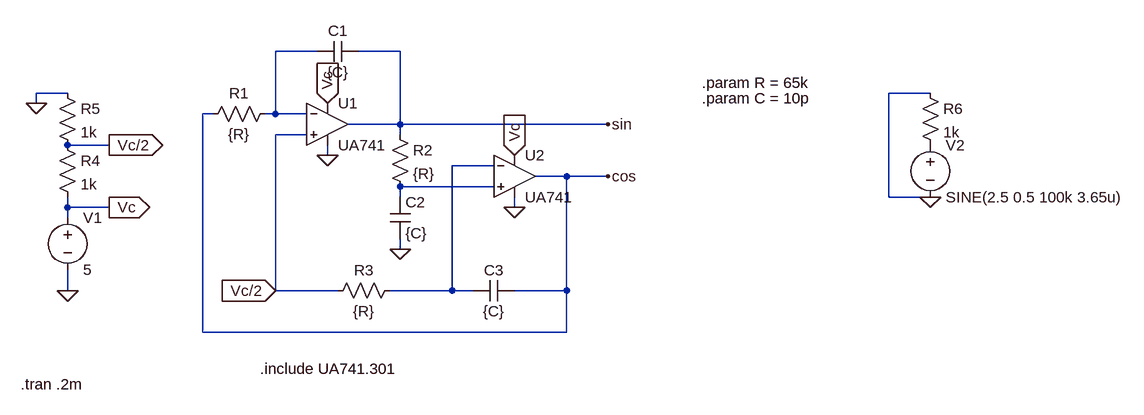
[diagram p0: schematic oscillator.asc]
oscillator.asc, the LTspice schematic file:
Version 4
SHEET 1 1364 680
WIRE 96 -160 32 -160
WIRE 224 -160 160 -160
WIRE -288 -96 -336 -96
WIRE 1040 -96 976 -96
WIRE -336 -80 -336 -96
WIRE -64 -64 -80 -64
WIRE 32 -64 32 -160
WIRE 32 -64 16 -64
WIRE 80 -64 32 -64
WIRE 224 -48 224 -160
WIRE 224 -48 144 -48
WIRE 544 -48 224 -48
WIRE 80 -32 32 -32
WIRE 224 -32 224 -48
WIRE -224 -16 -288 -16
WIRE 112 0 112 -16
WIRE 368 16 304 16
WIRE 480 32 432 32
WIRE 544 32 480 32
WIRE 368 48 224 48
WIRE 224 64 224 48
WIRE 976 64 976 -96
WIRE 1040 64 976 64
WIRE -288 80 -288 64
WIRE -224 80 -288 80
WIRE 400 80 400 64
WIRE -288 96 -288 80
WIRE 224 144 224 128
WIRE -288 208 -288 176
WIRE 32 208 32 -32
WIRE 128 208 32 208
WIRE 304 208 304 16
WIRE 304 208 208 208
WIRE 336 208 304 208
WIRE 480 208 480 32
WIRE 480 208 400 208
WIRE -80 272 -80 -64
WIRE 480 272 480 208
WIRE 480 272 -80 272
FLAG 224 144 0
FLAG 112 0 0
FLAG -288 208 0
FLAG -336 -80 0
FLAG -224 -16 Vc/2
IOPIN -224 -16 Out
FLAG -224 80 Vc
IOPIN -224 80 Out
FLAG 400 80 0
FLAG 112 -80 Vc
IOPIN 112 -80 In
FLAG 400 0 Vc
IOPIN 400 0 In
FLAG 544 32 cos
FLAG 544 -48 sin
FLAG 32 208 Vc/2
IOPIN 32 208 In
FLAG 1040 64 0
SYMBOL res 32 -80 R90
WINDOW 0 0 56 VBottom 2
WINDOW 3 32 56 VTop 2
SYMATTR InstName R1
SYMATTR Value {R}
SYMBOL cap 160 -176 R90
WINDOW 0 0 32 VBottom 2
WINDOW 3 32 32 VTop 2
SYMATTR InstName C1
SYMATTR Value {C}
SYMBOL res 208 -48 R0
SYMATTR InstName R2
SYMATTR Value {R}
SYMBOL cap 208 64 R0
SYMATTR InstName C2
SYMATTR Value {C}
SYMBOL res 224 192 R90
WINDOW 0 0 56 VBottom 2
WINDOW 3 32 56 VTop 2
SYMATTR InstName R3
SYMATTR Value {R}
SYMBOL cap 400 192 R90
WINDOW 0 0 32 VBottom 2
WINDOW 3 32 32 VTop 2
SYMATTR InstName C3
SYMATTR Value {C}
SYMBOL voltage -288 80 R0
WINDOW 123 0 0 Left 0
WINDOW 39 0 0 Left 0
SYMATTR InstName V1
SYMATTR Value 5
SYMBOL res -304 -32 R0
SYMATTR InstName R4
SYMATTR Value 1k
SYMBOL res -304 -112 R0
SYMATTR InstName R5
SYMATTR Value 1k
SYMBOL OpAmps\\opamp2 112 -112 R0
SYMATTR InstName U1
SYMATTR Value UA741
SYMBOL OpAmps\\opamp2 400 -32 R0
SYMATTR InstName U2
SYMATTR Value UA741
SYMBOL voltage 1040 -32 R0
WINDOW 123 0 0 Left 0
WINDOW 39 0 0 Left 0
SYMATTR InstName V2
SYMATTR Value SINE(2.5 0.5 100k 3.65u)
SYMBOL res 1024 -112 R0
SYMATTR InstName R6
SYMATTR Value 1k
TEXT 8 328 Left 2 !.include UA741.301
TEXT -360 352 Left 2 !.tran .2m
TEXT 688 -112 Left 2 !.param R = 65k
TEXT 688 -88 Left 2 !.param C = 10p

The netlist it stands for:
* oscillator.asc
R1 N001 cos {R}
C1 sin N001 {C}
R2 sin N003 {R}
C2 N003 0 {C}
R3 N002 Vc/2 {R}
C3 cos N002 {C}
V1 Vc 0 5
R4 Vc/2 Vc 1k
R5 0 Vc/2 1k
XU1 Vc/2 N001 Vc 0 sin UA741  ; pins In+ In- V+ V- OUT
XU2 N003 N002 Vc 0 cos UA741  ; pins In+ In- V+ V- OUT
V2 P001 0 SINE(2.5 0.5 100k 3.65u)
R6 0 P001 1k
.include UA741.301
.tran .2m
.param R = 65k
.param C = 10p
.backanno
.end